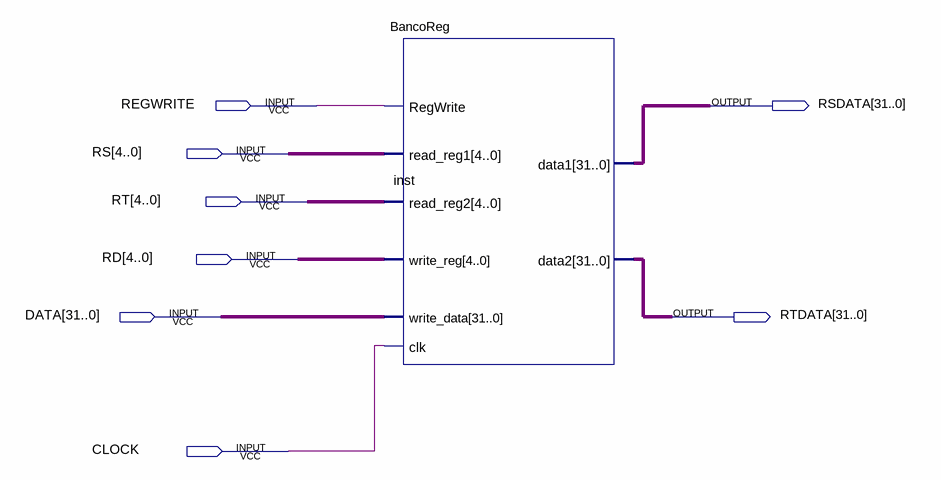
[diagram p0: schematic sheet]
// Quartus schematic BancoReg_test.bdf as structural Verilog: 1 symbols, 8 pins
module BancoReg_test (
  input  REGWRITE,
  input  [4:0] RS,
  input  [4:0] RT,
  input  [4:0] RD,
  input  [31:0] DATA,
  input  CLOCK,
  output [31:0] RSDATA,
  output [31:0] RTDATA
);

  BancoReg inst (
    .clk(CLOCK), .RegWrite(REGWRITE), .read_reg1(RS), .read_reg2(RT), .write_reg(RD), .write_data(DATA),
    .data1(RSDATA), .data2(RTDATA));
endmodule
